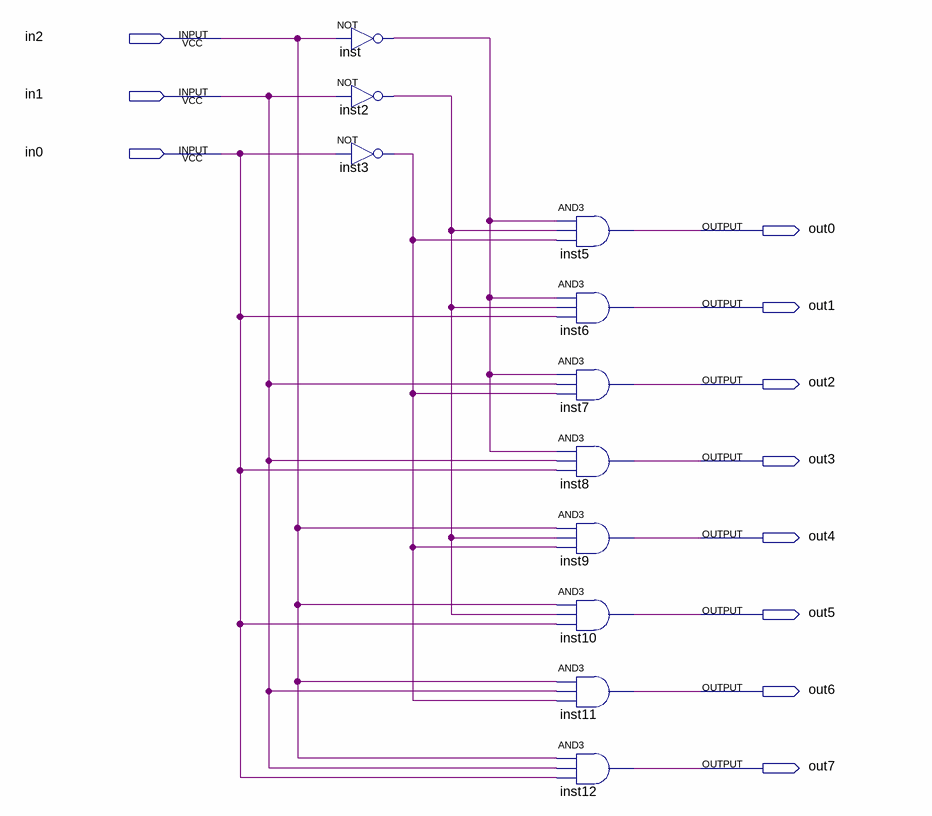
[diagram p0: schematic sheet]
// Quartus schematic dec3b.bdf as structural Verilog: 11 symbols, 11 pins
module dec3b (
  input  in2,
  input  in1,
  input  in0,
  output out0,
  output out1,
  output out2,
  output out3,
  output out4,
  output out5,
  output out6,
  output out7
);

  wire inst2_out, inst3_out, inst_out;

  not inst (inst_out, in2);
  not inst2 (inst2_out, in1);
  not inst3 (inst3_out, in0);
  and inst5 (out0, inst_out, inst2_out, inst3_out);
  and inst6 (out1, inst_out, inst2_out, in0);
  and inst7 (out2, inst_out, in1, inst3_out);
  and inst8 (out3, inst_out, in1, in0);
  and inst9 (out4, in2, inst2_out, inst3_out);
  and inst10 (out5, in2, inst2_out, in0);
  and inst11 (out6, in2, in1, inst3_out);
  and inst12 (out7, in2, in1, in0);
endmodule
